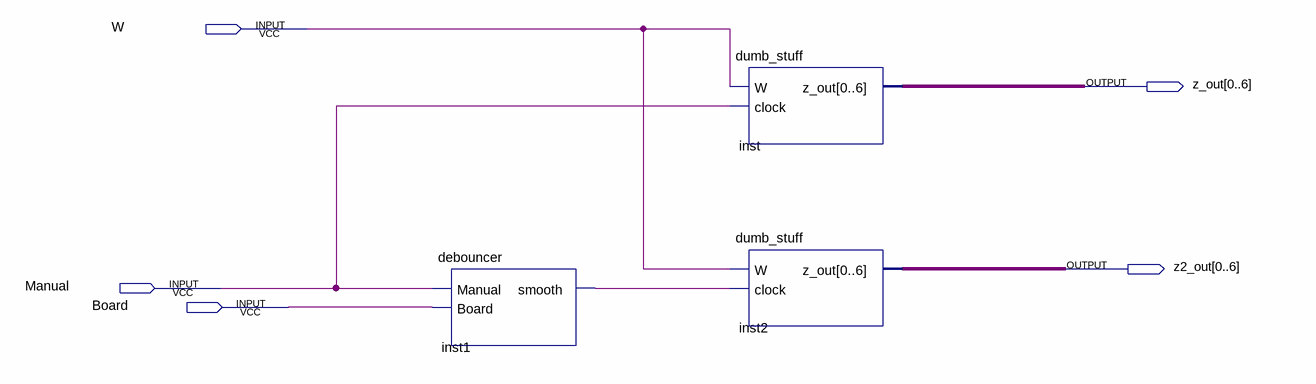
[diagram p0: schematic sheet]
// Quartus schematic test.bdf as structural Verilog: 3 symbols, 5 pins
module test (
  input  W,
  input  Manual,
  input  Board,
  output [0:6] z_out,
  output [0:6] z2_out
);

  wire inst1_smooth;

  debouncer inst1 (.Manual(Manual), .Board(Board), .smooth(inst1_smooth));
  dumb_stuff inst (.W(W), .clock(Manual), .z_out(z_out));
  dumb_stuff inst2 (.W(W), .clock(inst1_smooth), .z_out(z2_out));
endmodule
